# EAGLE design DotIO (EAGLE 7.7.0)
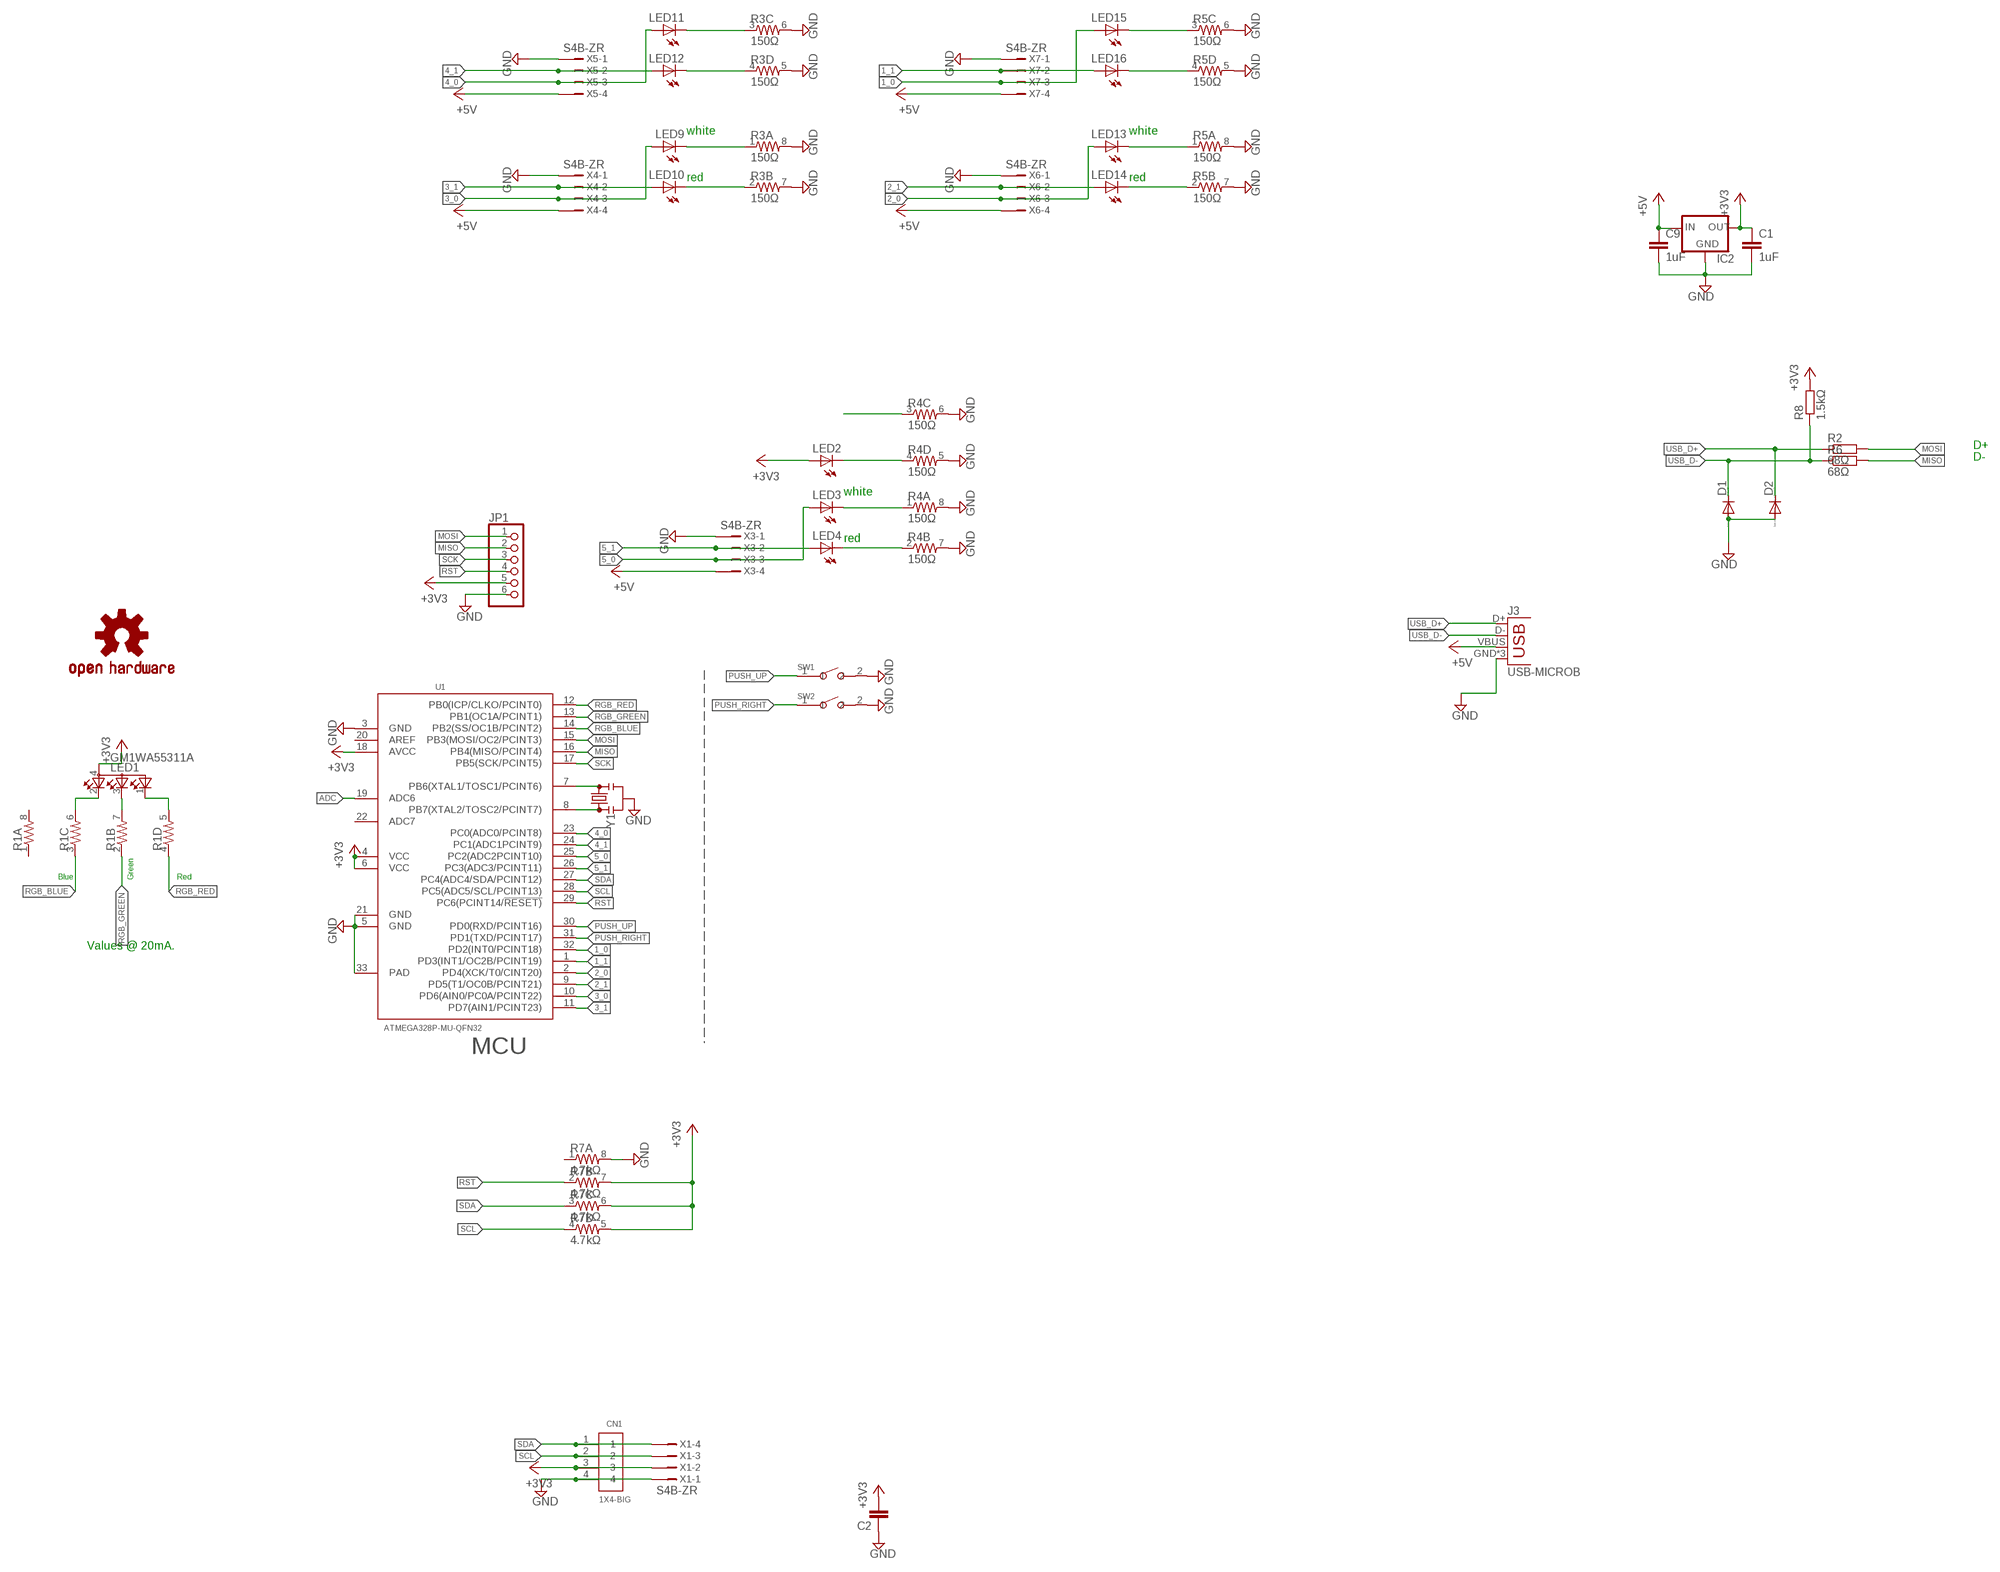
[diagram p0: schematic, sheet 1]

## Parts
C1  1uF  C-EUC0603  [C0603]
C2  C-EUC3216  [C3216]
C9  1uF  C-EUC0603  [C0603]
CN1  1X4-BIG  [1X04-BIG]
D1  DIODE-SOD523  [SOD523]
D2  DIODE-SOD523  [SOD523]
IC2  MCP1700TT  [SOT-23]
J3  USB-MICROB  [USB-MICROB]
JP1  PINHD-1X6  [1X06]
LED1  GM1WA55311A  [GM1WA55311A]
LED2  LED0603  [LED-0603]
LED3  LED0603  [LED-0603]
LED4  LED0603  [LED-0603]
LED9  LED0603  [LED-0603]
LED10  LED0603  [LED-0603]
LED11  LED0603  [LED-0603]
LED12  LED0603  [LED-0603]
LED13  LED0603  [LED-0603]
LED14  LED0603  [LED-0603]
LED15  LED0603  [LED-0603]
LED16  LED0603  [LED-0603]
LOGO1  OSHW-LOGOS  [OSHW-LOGO-S]
R1  RESISTOR-ARRAY0603-ARV  [0603-ARV]
R2  68Ω  R-EU_R0603  [R0603]
R3  150Ω  RESISTOR-ARRAY0603-ARV  [0603-ARV]
R4  150Ω  RESISTOR-ARRAY0603-ARV  [0603-ARV]
R5  150Ω  RESISTOR-ARRAY0603-ARV  [0603-ARV]
R6  68Ω  R-EU_R0603  [R0603]
R7  4.7kΩ  RESISTOR-ARRAY0603-ARV  [0603-ARV]
R8  1.5kΩ  R-EU_R0603  [R0603]
SW1  SMD-BUTTON(2P-6.0X3.0X2.5MM)-DHT-1163S  [SW2-4.0-6.0X3.0X2.5MM]
SW2  SMD-BUTTON(2P-6.0X3.0X2.5MM)-DHT-1163S  [SW2-4.0-6.0X3.0X2.5MM]
U1  ATMEGA328P-MU-QFN32  MCU-ATMEGA328P-MU(QFN32)  [QFN32G-0.5-5X5MM]
X1  S4B-ZR  [S4B-ZR]
X3  S4B-ZR  [S4B-ZR]
X4  S4B-ZR  [S4B-ZR]
X5  S4B-ZR  [S4B-ZR]
X6  S4B-ZR  [S4B-ZR]
X7  S4B-ZR  [S4B-ZR]
Y1  RESONATORSMD-3.2X1.3  [RESONATOR-SMD-3.2X1.3]

## Nets
1_0: LED15.A U1.32(PD2(INT0/PCINT18)) X7.3
1_1: LED16.A U1.1(PD3(INT1/OC2B/PCINT19)) X7.2
2_0: LED13.A U1.2(PD4(XCK/T0/CINT20)) X6.3
2_1: LED14.A U1.9(PD5(T1/OC0B/PCINT21)) X6.2
3_0: LED9.A U1.10(PD6(AIN0/PC0A/PCINT22)) X4.3
3_1: LED10.A U1.11(PD7(AIN1/PCINT23)) X4.2
4_0: LED11.A U1.23(PC0(ADC0/PCINT8)) X5.3
4_1: LED12.A U1.24(PC1(ADC1PCINT9)) X5.2
5_0: LED3.A U1.25(PC2(ADC2PCINT10)) X3.3
5_1: LED4.A U1.26(PC3(ADC3/PCINT11)) X3.2
+3V3: C1.1 C2.2 CN1.3 IC2.2(OUT) JP1.5 LED1.4(A) LED2.A R7.5 R7.6 R7.7 R8.2 U1.4(VCC) U1.6(VCC) U1.18(AVCC) X1.2
+5V: C9.1 IC2.3(IN) J3.VBUS X3.4 X4.4 X5.4 X6.4 X7.4
ADC: U1.19(ADC6)
GND: C1.2 C2.1 C9.2 CN1.4 D1.A D2.A IC2.1(GND) J3.GND J3.MT1(GND) J3.MT2(GND) JP1.6 R3.5 R3.6 R3.7 R3.8 R4.5 R4.6 R4.7 R4.8 R5.5 R5.6 R5.7 R5.8 R7.8 SW1.2 SW2.2 U1.3(GND) U1.5(GND) U1.21(GND) U1.33(PAD) X1.1 X3.1 X4.1 X5.1 X6.1 X7.1 Y1.2
MISO: JP1.2 R6.2 U1.16(PB4(MISO/PCINT4))
MOSI: JP1.1 R2.2 U1.15(PB3(MOSI/OC2/PCINT3))
N$1: LED1.3(CBLUE) R1.7
N$2: LED3.C R4.1
N$4: LED1.2(CRED) R1.6
N$6: U1.7(PB6(XTAL1/TOSC1/PCINT6)) Y1.3
N$7: LED2.C R4.4
N$8: U1.8(PB7(XTAL2/TOSC2/PCINT7)) Y1.1
N$9: LED4.C R4.2
N$10: R4.3
N$14: LED9.C R3.1
N$15: LED1.1(CGREEN) R1.5
N$16: LED10.C R3.2
N$17: LED11.C R3.3
N$18: LED12.C R3.4
N$19: LED13.C R5.1
N$20: LED14.C R5.2
N$21: LED15.C R5.3
N$22: LED16.C R5.4
PUSH_RIGHT: SW2.1 U1.31(PD1(TXD/PCINT17))
PUSH_UP: SW1.1 U1.30(PD0(RXD/PCINT16))
RGB_BLUE: R1.3 U1.14(PB2(SS/OC1B/PCINT2))
RGB_GREEN: R1.2 U1.13(PB1(OC1A/PCINT1))
RGB_RED: R1.4 U1.12(PB0(ICP/CLKO/PCINT0))
RST: JP1.4 R7.2 U1.29(PC6(PCINT14/!RESET))
SCK: JP1.3 U1.17(PB5(SCK/PCINT5))
SCL: CN1.2 R7.4 U1.28(PC5(ADC5/SCL/PCINT13)) X1.3
SDA: CN1.1 R7.3 U1.27(PC4(ADC4/SDA/PCINT12)) X1.4
USB_D+: D2.C J3.D+ R2.1
USB_D-: D1.C J3.D- R6.1 R8.1
Unconnected: R1.1 R1.8 R7.1 U1.20(AREF) U1.22(ADC7)

## Notes on the sheet
- white | white
- red | red
- D+
- D-
- white
- red
- Blue | Green | Red
- Values @ 20mA.
- MCU

## Library data of the parts
C1 C2 C9 = rcl:C-EU: CAPACITOR, European symbol
CN1 = adafruit:1X4: 4-pin connector
D1 D2 = diode:DIODE-: DIODE
IC2 = MCP1700:MCP1700: Microchip MCP1700 positive regulator
J3 = SparkFun-Retired:USB: USB Connectors USB-B-PTH is fully proven SKU : PRT-00139/CONN-08278 USB-miniB is fully proven SKU : PRT-00587 USB-A-PCB is untested. USB-A-H is throughly reviewed, but untested. Spark Fun Electronics SKU : PRT-00437 USB-B-SMT is throughly reviewed, but untested. Needs silkscreen touching up. USB-A-S has not been used/tested USB-MB-H has not been used/tested USB-MICROB has been used. CONN-09505; PROD_ID: CONN-09505
JP1 = adafruit:PINHD-1X6: PIN HEADER
LED1 = led:GM1WA55311A: Chip LED RGB Source: http://document.sharpsma.com/files/GM1WA55311A_SS.pdf
LED2-LED4 LED9-LED16 = SparkFun:LED: LEDs Standard schematic elements and footprints for 5mm, 3mm, 1206, and 0603 sized LEDs. 5mm - Spark Fun Electronics SKU : COM-00529 (and others)
LOGO1 = Spark:OSHW-LOGO: Open Source Hardware Logo This logo indicates the piece of hardware it is found on incorporates a OSHW license and/or adheres to the definition of open source hardware found here: http://freedomdefined.org/OSHW
R1 R3-R5 R7 = SparkFun:RESISTOR-ARRAY: Array Chip Resistor Source: RS Component / Phycomp
R2 R6 R8 = rcl:R-EU_: RESISTOR, European symbol
SW1 SW2 = Seeed-OPL-Switch:SMD-BUTTON(2P-6.0X3.0X2.5MM): 311020029
U1 = Seeed-OPL-ic:MCU-ATMEGA328P-MU(QFN32): 310010005; MPN: ATMEGA328P-MU
X1 X3-X7 = con-jst:?4B-ZR: ZH CONNECTOR 1.5 mm, 4 pin 1 row Source: http://www.jst.com .. eZH.pdf; MF: FARNELL; MPN: S4B-ZR(LF)(SN); OC_FARNELL: 9491830; OC_NEWARK: 38K8076
Y1 = SparkFun-Clocks:RESONATOR: Resonators (Generic) Ceramic resonators are clock-generating components, often used to control timing in microcontrollers. They usually have 3 pins: two pins for oscillation, and one pin for ground. Compared to crystals, resonators have worse tolerance, but are usually much cheaper. Plus, they have built-in load capacitors! These devices are used on boards like the Arduino Pro 8MHz <https://www.sparkfun.com/products/11114> and Arduino Pro 16MHz <https://www.sparkfun.com/products/11113>.

## Board
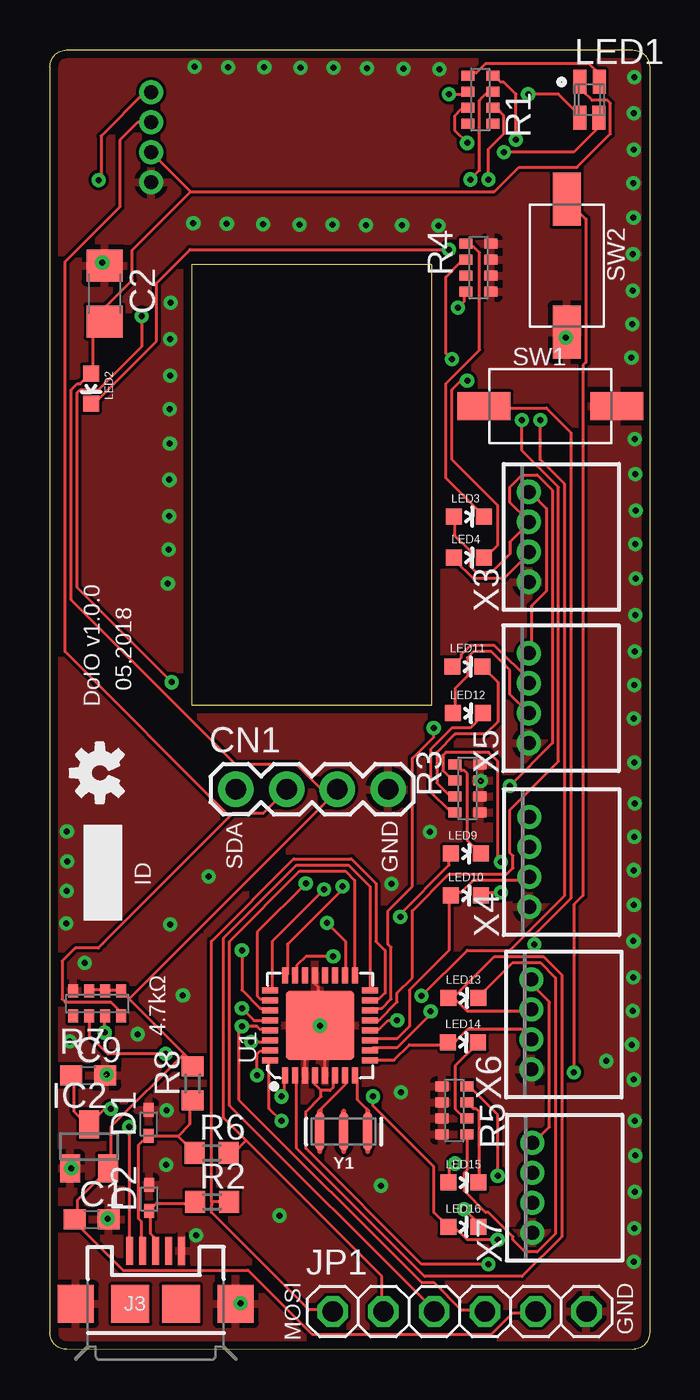
[diagram p1: board, top side]
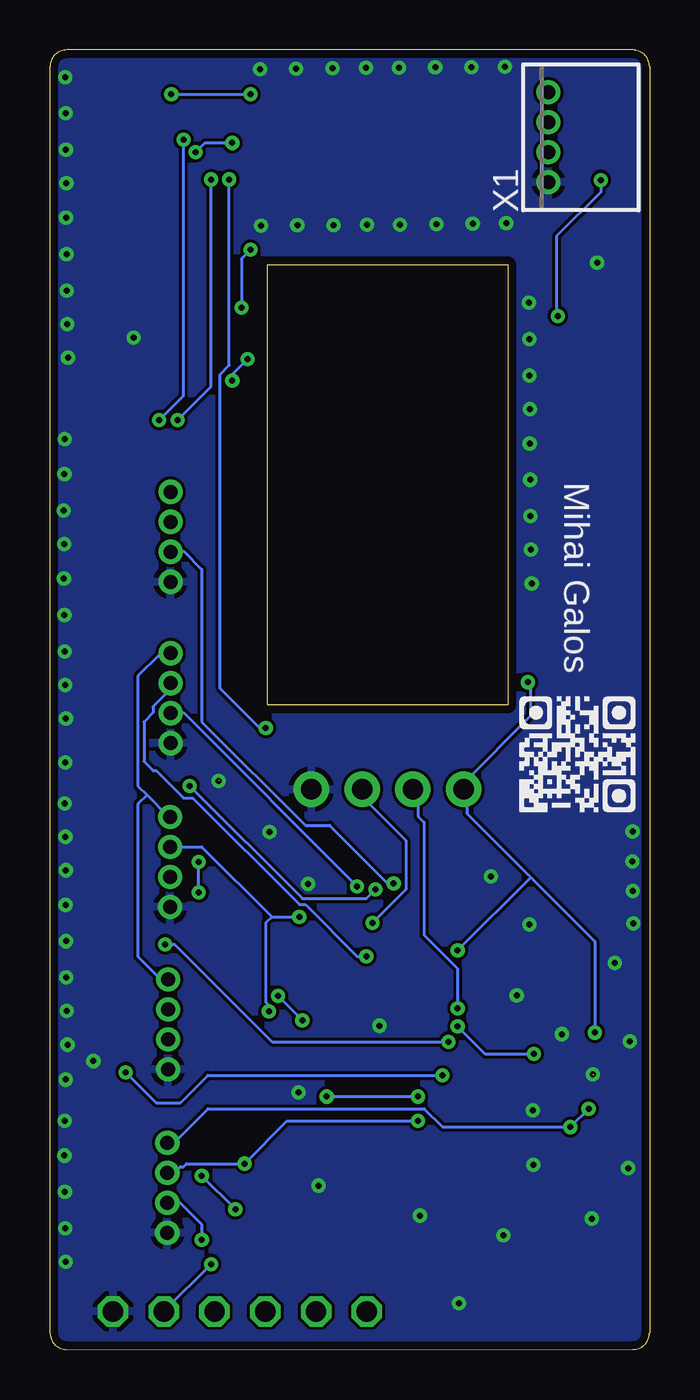
[diagram p2: board, bottom side, seen from below]

Size 30 x 65 mm. Coordinates in mm from the lower left corner, seen from the top.
Outline: 30,0.84 arc-90 29.17,0 0.84,0 arc-90 0,0.83 0,64.16 arc-90 0.83,65
Outline: 0.82,65 29.16,65 arc-90 30,64.17 30,0.84
Outline: 7.09,32.23 19.11,32.23 19.11,54.27 7.09,54.27 7.09,32.23
Copper layers (1*16): Top 0.035mm / dielectric 1.5mm / Bottom 0.035mm
Design rules "Mihai_default *": minimum track width 6mil, minimum drill 0.3mm, track to track 6mil, track to pad 6mil, pad to pad 6mil, via to via 6mil, smd to smd 6mil, copper to edge 16mil, drill to drill 8mil, minimum pad ring 10mil, minimum via ring 8mil, stop-mask expansion 4mil, vias tented up to drill 0mil, thermal gap 10mil
vRestrict: area 10.7,13.3 to 16.5,19.1; area 0.9,27 to 4.3,38.3

### Footprints (pad centres in the part's own frame; a part is rotated, then mirrored left to right if it is on the bottom)
C0603 = smd 1.1 x 1: 1 -0.85,0; 2 0.85,0
C3216 = smd 1.6 x 1.8: 1 -1.4,0; 2 1.4,0
1X04-BIG = drill 1.016 pad 1.778: 1 0,0; 2 2.54,0; 3 5.08,0; 4 7.62,0
SOD523 = smd 0.7 x 0.5: A 0.7,0; C -0.6,0
SOT-23 = smd 1 x 1.4: 1 -0.95,-1.1; 2 0.95,-1.1; 3 0,1.1
USB-MICROB = smd 0.35 x 1.4: D+ 0,2.65; D- -0.65,2.65; GND 1.3,2.65; ID 0.65,2.65; VBUS -1.3,2.65 | smd 1.8 x 1.9: MT1 -4,0; MT2 4,0 | smd 1.9 x 1.9: P$1 -1.27,0; P$2 1.27,0
1X06 = drill 1.016 octagon: 1 -6.35,0; 2 -3.81,0; 3 -1.27,0; 4 1.27,0; 5 3.81,0; 6 6.35,0
GM1WA55311A = smd 0.65 x 1.2: 1 0.477,0.9; 2 -0.475,-0.9; 3 0.475,-0.9; 4 -0.477,0.9
LED-0603 = smd 0.8 x 0.8: A 0,-0.75; C 0,0.75
0603-ARV = smd 0.5 x 0.65: 1 -1.2,-0.625; 2 -0.4,-0.625; 3 0.4,-0.625; 4 1.2,-0.625; 5 1.2,0.625; 6 0.4,0.625; 7 -0.4,0.625; 8 -1.2,0.625
R0603 = smd 1 x 1.1: 1 -0.85,0; 2 0.85,0
SW2-4.0-6.0X3.0X2.5MM = smd 2.65 x 1.4: 1 -3.325,0; 2 3.325,0
QFN32G-0.5-5X5MM = smd 0.813 x 0.279: 1 -2.5,1.75; 2 -2.5,1.25; 3 -2.5,0.75; 4 -2.5,0.25; 5 -2.5,-0.25; 6 -2.5,-0.75; 7 -2.5,-1.25; 8 -2.5,-1.75; 17 2.5,-1.75; 18 2.5,-1.25; 19 2.5,-0.75; 20 2.5,-0.25; 21 2.5,0.25; 22 2.5,0.75; 23 2.5,1.25; 24 2.5,1.75 | smd 0.279 x 0.813: 9 -1.75,-2.5; 10 -1.25,-2.5; 11 -0.75,-2.5; 12 -0.25,-2.5; 13 0.25,-2.5; 14 0.75,-2.5; 15 1.25,-2.5; 16 1.75,-2.5; 25 1.75,2.5; 26 1.25,2.5; 27 0.75,2.5; 28 0.25,2.5; 29 -0.25,2.5; 30 -0.75,2.5; 31 -1.25,2.5; 32 -1.75,2.5 | smd 3.429 x 3.429: 33 0,0
S4B-ZR = drill 0.7 pad 1.1: 1 -2.25,0; 2 -0.75,0; 3 0.75,0; 4 2.25,0
RESONATOR-SMD-3.2X1.3 = smd 0.45 x 1.905: 1 -1.2,0; 2 0,0; 3 1.2,0

### Placement (x,y rotation side)
C1  2.09,6.5 0 top
C2  2.73,52.82 270 top
C9  1.92,13.71 0 top
CN1  9.3,28.02 0 top
D1  4.95,11.28 90 top
D2  4.97,7.53 90 top
IC2  1.96,10.16 0 top
J3  5.29,2.28 0 top
JP1  20.5,1.9 0 top
LED1  27,62.5 0 top
LED2  2.06,48.07 180 top
LED3  20.96,41.66 270 top
LED4  20.97,39.62 270 top
LED9  20.82,24.8 270 top
LED10  20.81,22.72 270 top
LED11  20.89,34.17 270 top
LED12  20.91,31.83 270 top
LED13  20.7,17.59 270 top
LED14  20.66,15.37 270 top
LED15  20.68,8.35 270 top
LED16  20.68,6.13 270 top
LOGO1  2.5,28.84 90 top
R1  21.53,62.52 90 top
R2  8.12,7.39 0 top
R3  20.88,28.07 270 top
R4  21.44,54.11 270 top
R5  20.23,11.95 90 top
R6  8.1,9.84 0 top
R7  2.37,17.31 0 top
R8  7.14,13.32 90 top
SW1  25.04,47.18 0 top
SW2  25.86,54.21 270 top
U1  13.52,16.21 90 top
X1  5.06,60.64 90 bottom
X3  23.97,40.65 90 top
X4  23.98,24.38 90 top
X5  23.96,32.58 90 top
X6  24.09,16.26 90 top
X7  24.13,8.09 90 top
Y1  14.7,10.92 180 top

### Tracks (layer width: path | path; a pad name or v marks a point on that pad's centre or on a via)
1_0  (via drill 0.3)
  Top 0.152: v20.27,9.3 19.96,8.99 19.96,8.38 LED15.A | v11.58,11.43 10.97,12.04 10.97,14.33 U1.32
  Bottom 0.152: X7.3 24.08,8.99 23.62,8.99 23.47,9.15 23.32,9.15 23.16,9.3 v20.27,9.3 18.14,11.43 v11.58,11.43
1_1  (via drill 0.3)
  Top 0.152: v22.4,5.49 20.88,5.49 20.27,6.1 19.96,6.1 LED16.A 19.81,6.25 19.2,6.86 19.2,9.15 16.15,12.19 v16.15,12.65 | v11.58,12.65 11.73,12.8 11.73,13.57 U1.1
  Bottom 0.152: v22.4,5.49 22.4,6.25 23.47,7.32 24.08,7.32 X7.2 | v16.15,12.65 v11.58,12.65
2_0
  Top 0.152: 20.12,17.53 20.27,17.53 20.88,16.92 24.08,16.92 X6.3 | 20.12,17.53 19.96,17.53 LED13.A 20.12,17.53 | 20.12,17.53 22.25,19.66 24.69,19.66 25.6,18.75 25.6,5.64 23.62,3.66 18.75,3.66 12.34,10.06 12.34,13.57 U1.2
2_1
  Top 0.152: U1.9 16.15,14.48 17.22,14.48 17.98,15.24 19.81,15.24 LED14.A 19.96,15.39 20.27,15.39 20.88,16 23.62,16 24.08,15.55 X6.2
3_0  (via drill 0.3)
  Top 0.152: v17.53,21.64 17.53,21.8 19.96,24.23 19.96,24.69 LED9.A | v19.05,16.92 19.05,16.77 17.37,15.09 16.15,15.09 U1.10
  Bottom 0.152: 18.9,21.64 v17.53,21.64 | 18.9,21.64 22.4,25.15 23.93,25.15 X4.3 | v19.05,16.92 19.05,17.22 19.2,17.38 19.2,21.34 18.9,21.64
3_1
  Top 0.152: X4.2 23.93,23.62 23.77,23.47 21.18,23.47 20.57,22.86 20.12,22.86 LED10.A 19.96,22.71 19.96,19.97 17.98,17.99 17.98,16.16 17.37,15.55 16.15,15.55 U1.11
4_0  (via drill 0.3)
  Top 0.152: LED11.A 20.27,34.29 20.57,34.6 20.57,34.75 21.03,35.21 22.25,35.21 24.08,33.38 X5.3 | v14.17,19.66 12.8,19.66 12.34,19.2 12.34,18.75 U1.23
  Bottom 0.152: v14.17,19.66 14.63,19.66 17.22,22.25 17.53,22.25 22.86,27.59 23.32,27.59 24.69,28.96 24.84,28.96 25.3,29.42 25.3,31.4 24.84,31.85 24.84,32.16 24.08,32.92 24.08,33.23 X5.3
4_1  (via drill 0.3)
  Top 0.152: LED12.A 20.27,31.85 20.27,33.07 20.88,33.68 20.88,34.6 21.18,34.9 22.1,34.9 23.01,33.99 23.01,32.77 23.93,31.85 X5.2 | v14.63,23.17 14.63,23.01 11.89,20.27 11.89,18.75 U1.24
  Bottom 0.152: v14.63,23.17 23.32,31.85 23.93,31.85 X5.2
5_0  (via drill 0.3)
  Top 0.152: LED3.A 20.27,41.61 20.27,40.69 21.03,39.93 21.03,39.17 21.34,38.86 22.1,38.86 23.01,39.78 23.01,40.39 23.93,41.3 X3.3 23.93,41.46 23.01,42.37 23.01,43.13 23.62,43.74 24.38,43.74 25.15,42.98 25.15,30.33 v23.01,28.2 | v13.72,23.01 11.12,20.42 11.12,17.99 U1.25
  Bottom 0.152: v13.72,23.01 14.17,22.56 17.37,22.56 v23.01,28.2
5_1  (via drill 0.3)
  Top 0.152: LED4.A 20.27,39.47 21.18,38.56 22.71,38.56 23.93,39.78 X3.2 | v12.8,23.32 10.36,20.88 10.36,17.68 10.52,17.53 10.97,17.53 U1.26
  Bottom 0.152: v12.8,23.32 13.11,23.32 16,26.22 17.22,26.22 22.4,31.4 22.4,39.02 23.32,39.93 23.93,39.93 X3.2
+3V3  (via drill 0.3)
  Top 0.152: 7.03,57.91 22.25,57.91 23.47,59.13 26.36,59.13 28.04,60.81 28.04,62.33 27.89,62.49 27.13,62.49 26.67,62.94 26.67,63.4 LED1.4 | 13.56,12.96 13.26,13.26 13.26,13.57 U1.4 | 13.56,12.96 14.02,12.96 14.17,13.11 14.17,13.57 U1.6 | 13.56,12.96 13.56,12.65 12.8,11.89 12.8,10.06 18.59,4.27 v21.95,4.27 | v13.87,21.34 14.78,20.42 14.78,18.75 U1.18 | R7.7 1.98,17.99 2.74,17.99 R7.6 2.9,17.99 3.5,17.99 R7.5 3.66,17.83 3.96,17.53 | 3.96,17.53 6.71,14.79 | 6.71,14.79 7.01,14.48 7.01,14.18 R8.2 | 6.71,14.79 3.05,11.13 3.05,9.15 IC2.2 2.9,8.99 1.37,7.47 1.37,6.56 C1.1 1.22,6.4 3.66,3.96 9.91,3.96 13.11,0.76 22.1,0.76 23.16,1.83 24.23,1.83 JP1.5 | 3.96,17.53 14.02,27.59 | 14.02,27.59 14.33,27.89 CN1.3 14.02,27.59 | 14.02,27.59 12.34,29.26 9.3,29.26 1.07,37.49 1.07,48.01 1.37,48.31 1.52,48.31 1.98,48.77 LED2.A 2.13,48.92 2.13,50.9 2.59,51.36 C2.2 2.74,51.51 2.74,52.12 4.12,53.49 4.12,55 7.03,57.91 | 7.03,57.91 X1.2
  Bottom 0.152: v21.95,4.27 24.23,1.98 JP1.5 | v13.87,21.34 12.19,23.01 12.19,25.45 14.33,27.59 14.33,27.89 CN1.3
+5V  (via drill 0.3)
  Top 0.152: C9.1 1.22,13.57 1.22,11.89 1.83,11.28 IC2.3 1.98,11.28 2.74,12.04 v3.05,12.04 | v3.96,11.13 3.96,5.03 J3.VBUS | X6.4 24.23,18.44 24.23,18.14 24.99,17.38 24.99,11.13 24.23,10.37 X7.4 | X5.4 24.08,34.9 24.08,37.19 24.84,37.95 24.84,42.06 24.08,42.83 X3.4
  Bottom 0.152: v3.05,12.04 v3.96,11.13 10.36,11.13 11.28,12.04 22.1,12.04 23.77,10.37 24.08,10.37 X7.4 | 25.15,27.74 25.6,28.2 25.6,33.68 24.54,34.75 24.08,34.75 X5.4 | 25.15,27.74 24.08,26.67 X4.4 | 25.15,27.74 25.6,27.28 25.6,19.66 24.54,18.6 24.23,18.6 X6.4
GND  (via drill 0.3)  (2 unrouted)
  Top 0.152: U1.21 13.26,18.6 13.26,18.29 13.41,18.14 13.41,16.31 U1.33 12.77,15.46 U1.3 | U1.5 13.77,15.95 v13.52,16.2
  other vias: 7.23,64.17 2.62,54.36 0.85,25.91 6,21.26 7.94,23.66 6.65,17.72 11.48,6.7 16.56,8.2 27.83,14.43 9.54,2.31 7.32,5.71 5.8,9.24 5.83,11.97 2.85,13.76 4.38,15.77 0.81,21.32 0.99,15.41 1.73,19.33 17.57,12.87 2.88,6.55 1.07,9.07 29.1,49.61 25.8,50.62 8.9,64.14 10.72,64.13 12.54,64.11 14.19,64.11 15.86,64.08 17.68,64.07 19.5,64.05 29.18,58.34 29.2,60.01 29.21,61.83 29.24,63.65 29.14,51.3 29.16,52.97 29.18,54.79 29.2,56.61 29.29,40.29 29.31,41.96 29.28,43.79 29.26,45.54 29.25,33.25 29.27,34.92 29.28,36.74 29.3,38.56 29.2,31.56 29.2,23.97 29.23,25.65 29.26,27.32 29.24,29.36 29.16,16.93 29.19,18.61 29.2,20.43 29.23,22.24 29.12,15.25 29.26,11.43 29.21,13.5 29.22,4.39 29.25,6.07 29.25,7.89 29.28,9.7 0.87,24.41 0.83,22.94 7.17,56.33 8.85,56.31 10.67,56.3 12.48,56.27 14.13,56.27 15.8,56.25 17.62,56.24 19.44,56.21 5.98,47.05 6,48.72 6.01,50.54 6.04,52.36 5.94,40.01 5.96,41.68 5.97,43.5 6,45.32 5.9,38.32 19.02,25.88 21.57,28.45 17.09,23.29
  pour Top: 0,-0.1 29.9,-0.1 29.9,65 0,65
  pour Bottom: 0,0 29.9,0 29.9,65 0,65
MISO
  Top 0.152: 9.82,10.45 16.61,3.66 16.61,1.98 JP1.2 | 9.82,10.45 8.69,11.58 8.69,20.58 12.34,24.23 14.94,24.23 16,23.17 16,17.99 U1.16 | R6.2 9.21,9.84 9.82,10.45
MOSI
  Top 0.152: 8.08,7.39 8.08,20.42 12.19,24.54 15.09,24.54 16.31,23.32 16.31,20.42 16.76,19.97 16.76,17.83 16.46,17.53 16.15,17.53 U1.15 | JP1.1 14.02,1.98 12.95,1.98 8.08,6.86 8.08,7.2 8.08,7.39 | R2.2 8.08,7.39
N$1  (via drill 0.3)
  Top 0.152: v20.88,60.35 20.27,60.96 20.27,61.72 20.57,62.03 20.88,62.03 R1.7 | v22.71,59.9 26.21,59.9 27.43,61.11 27.43,61.57 LED1.3
  Bottom 0.152: v20.88,60.35 22.25,60.35 v22.71,59.9
N$2
  Top 0.152: R4.1 20.88,55.17 21.18,55.17 21.49,54.87 21.49,49.99 19.81,48.31 19.81,43.59 21.64,41.76 LED3.C
N$4  (via drill 0.3)
  Top 0.152: v19.96,62.79 20.88,62.79 R1.6 | v23.93,62.79 25.45,62.79 26.52,61.72 LED1.2
  Bottom 0.152: v23.93,62.79 v19.96,62.79
N$6
  Top 0.152: U1.7 14.78,13.57 14.78,13.26 13.56,12.04 Y1.3
N$7  (via drill 0.3)
  Top 0.152: v20.42,52.12 20.73,52.43 20.73,52.89 R4.4 | v19.96,55.02 7.01,55.02 5.33,53.34 5.33,50.45 2.13,47.25 LED2.C
  Bottom 0.152: v20.42,52.12 20.42,54.56 v19.96,55.02
N$8
  Top 0.152: U1.8 15.39,13.57 15.39,12.5 15.85,12.04 Y1.1
N$9  (via drill 0.3)
  Top 0.152: v20.12,49.53 19.81,49.84 19.81,53.65 20.57,54.41 20.73,54.41 R4.2 | v20.88,48.47 20.57,48.47 20.12,48.01 20.12,44.5 22.4,42.22 22.4,40.24 21.79,39.63 LED4.C
  Bottom 0.152: v20.12,49.53 20.88,48.77 v20.88,48.47
N$14
  Top 0.152: R3.1 20.27,29.26 20.57,28.96 20.73,28.96 20.88,28.81 20.88,25.45 21.49,24.84 LED9.C
N$15
  Top 0.152: R1.5 21.03,63.86 21.34,63.86 21.79,64.32 26.98,64.32 27.43,63.86 27.43,63.55 LED1.1
N$16  (via drill 0.3)
  Top 0.152: v22.55,24.39 22.4,24.54 22.4,29.42 21.95,29.87 19.81,29.87 19.66,29.72 19.66,28.96 20.12,28.5 R3.2 | v22.55,22.86 21.64,22.86 LED10.C
  Bottom 0.152: v22.55,22.86 v22.55,24.39
N$17
  Top 0.152: R3.3 20.12,27.74 19.96,27.74 19.36,28.35 19.36,29.87 20.27,30.79 21.79,30.79 22.4,31.4 22.4,33.38 21.64,34.14 LED11.C
N$18
  Top 0.152: R3.4 20.12,26.98 19.96,26.98 19.05,27.89 19.05,30.03 20.12,31.09 21.03,31.09 21.64,31.7 LED12.C
N$19
  Top 0.152: R5.1 20.88,10.67 20.88,8.99 20.73,8.84 20.73,7.93 21.79,6.86 21.95,6.86 23.16,5.64 23.16,5.49 23.77,4.88 24.38,4.88 25.3,5.79 25.3,18.6 24.54,19.36 23.16,19.36 21.49,17.68 LED13.C
N$20
  Top 0.152: R5.2 20.73,11.58 20.27,12.04 20.27,14.18 21.34,15.24 LED14.C
N$21
  Top 0.152: R5.3 20.88,12.35 21.18,12.04 21.34,12.04 21.49,11.89 21.49,8.38 LED15.C
N$22  (via drill 0.3)
  Top 0.152: v22.4,8.69 22.4,11.74 21.03,13.11 20.88,13.11 R5.4 | v20.73,7.01 21.49,6.25 LED16.C
  Bottom 0.152: v20.73,7.01 v22.4,8.69
PUSH_RIGHT  (via drill 0.3)
  Top 0.152: v10.36,13.72 10.36,14.79 10.52,14.94 10.97,14.94 U1.31 | v26.21,13.87 26.21,22.25 26.67,22.71 26.67,49.23 26.82,49.38 26.82,56.54 25.91,57.46 SW2.1
  Bottom 0.152: v10.36,13.72 22.1,13.72 23.47,12.35 24.69,12.35 v26.21,13.87
PUSH_UP  (via drill 0.3)
  Top 0.152: v10.06,15.39 10.97,15.39 U1.30 | v24.23,20.27 24.23,20.73 26.06,22.56 26.06,45.87 24.84,47.09 21.79,47.09 SW1.1
  Bottom 0.152: v10.06,15.39 18.9,15.39 23.77,20.27 v24.23,20.27
RGB_BLUE  (via drill 0.3)
  Top 0.152: v21.03,58.52 21.49,58.98 21.49,62.49 21.79,62.79 22.1,62.79 R1.3 | v19.2,31.09 19.2,30.63 18.14,29.57 18.14,23.17 16.92,21.95 16.92,20.27 17.07,20.12 17.07,17.53 16.61,17.07 16.15,17.07 U1.14
  Bottom 0.152: v21.03,58.52 21.03,49.23 21.49,48.77 21.49,33.07 19.51,31.09 v19.2,31.09
RGB_GREEN  (via drill 0.3)
  Top 0.152: v21.95,58.52 21.95,60.05 22.71,60.81 22.71,61.72 22.4,62.03 22.25,62.03 R1.2 | v23.62,46.48 23.62,44.96 25.45,43.13 25.45,29.42 23.01,26.98 23.01,24.84 23.16,24.69 23.16,24.08 22.86,23.78 19.96,23.78 18.14,21.95 18.14,18.6 17.37,17.83 17.37,17.38 16.46,16.46 16.15,16.46 U1.13
  Bottom 0.152: v21.95,58.52 21.95,48.16 v23.62,46.48
RGB_RED  (via drill 0.3)
  Top 0.152: v23.32,60.51 23.32,62.79 22.71,63.4 22.55,63.4 22.25,63.71 R1.4 | v24.54,46.48 24.54,44.5 25.76,43.28 25.76,22.71 23.01,19.97 20.88,19.97 v18.59,17.68 | v17.37,16.46 16.92,16.46 16.46,16 16.15,16 U1.12
  Bottom 0.152: v23.32,60.51 23.32,47.7 v24.54,46.48 | v17.37,16.46 v18.59,17.68
RST  (via drill 0.3)
  Top 0.152: v5.79,14.79 2.9,14.79 1.98,15.7 1.98,16.61 R7.2 | U1.29 10.97,16 10.52,16 10.36,16.16 v9.6,16.16 9.45,16 9.45,12.5 18.59,3.36 19.2,3.36 20.57,1.98 21.64,1.98 JP1.4
  Bottom 0.152: v5.79,14.79 8.23,14.79 v9.6,16.16
SCK
  Top 0.152: U1.17 15.24,18.75 15.24,23.47 14.78,23.93 12.5,23.93 8.99,20.42 8.99,12.19 19.2,1.98 JP1.3
SCL  (via drill 0.3)
  Top 0.152: 8.99,26.67 9.14,26.82 10.67,26.82 11.73,27.89 CN1.2 | 8.99,26.67 2.65,20.31 2.42,20.08 1.26,20.08 0.61,19.43 0.61,17.53 0.76,17.38 3.05,17.38 3.5,16.92 3.5,16.77 R7.4 | v9.6,17.07 10.21,16.46 10.97,16.46 U1.28 | 8.99,26.67 0.76,34.9 0.76,54.41 3.5,57.15 3.5,59.29 3.49,59.3 3.49,60.48 4.39,61.39 X1.3
  Bottom 0.152: v9.6,17.07 9.6,19.05 11.28,20.73 11.28,26.37 11.58,26.67 11.58,27.74 11.73,27.89 CN1.2
SDA  (via drill 0.3)
  Top 0.152: v2.74,15.85 2.74,16.61 R7.3 | v9.6,19.97 9.6,17.99 10.52,17.07 10.97,17.07 U1.27 | v6.1,33.38 1.37,38.1 1.37,47.86 1.52,48.01 2.44,48.01 4.58,50.16 v4.58,51.7 | X1.4 4.75,62.89 2.56,60.69 2.56,58.62 v2.44,58.5
  Bottom 0.152: v2.74,15.85 2.74,20.42 5.94,23.62 | 5.94,23.62 9.14,26.82 9.14,27.74 9.3,27.89 CN1.1 9.3,28.04 9.3,28.35 5.94,31.7 5.94,33.23 v6.1,33.38 | 5.94,23.62 v9.6,19.97 | v2.44,58.5 2.44,57.9 4.66,55.68 4.66,51.77 v4.58,51.7
USB_D+
  Top 0.152: J3.D+ 5.18,5.03 5.18,5.64 5.03,5.79 5.03,6.86 D2.C 5.03,7.01 5.33,7.32 7.16,7.32 R2.1
USB_D-
  Top 0.152: 6.4,10.67 5.03,10.67 D1.C 4.88,10.67 4.42,10.21 4.42,6.56 4.57,6.4 4.57,5.03 J3.D- | 6.4,10.67 7.16,9.91 R6.1 | 6.4,10.67 7.01,11.28 7.01,12.35 R8.1

### Text on the board
tPlace: 05.2018 | DoIO v1.0.0 | SDA | GND | ID | 4.7kΩ | GND | MOSI
bPlace: Mihai Galos